# EAGLE design GD32F207RG (EAGLE 9.6.2)
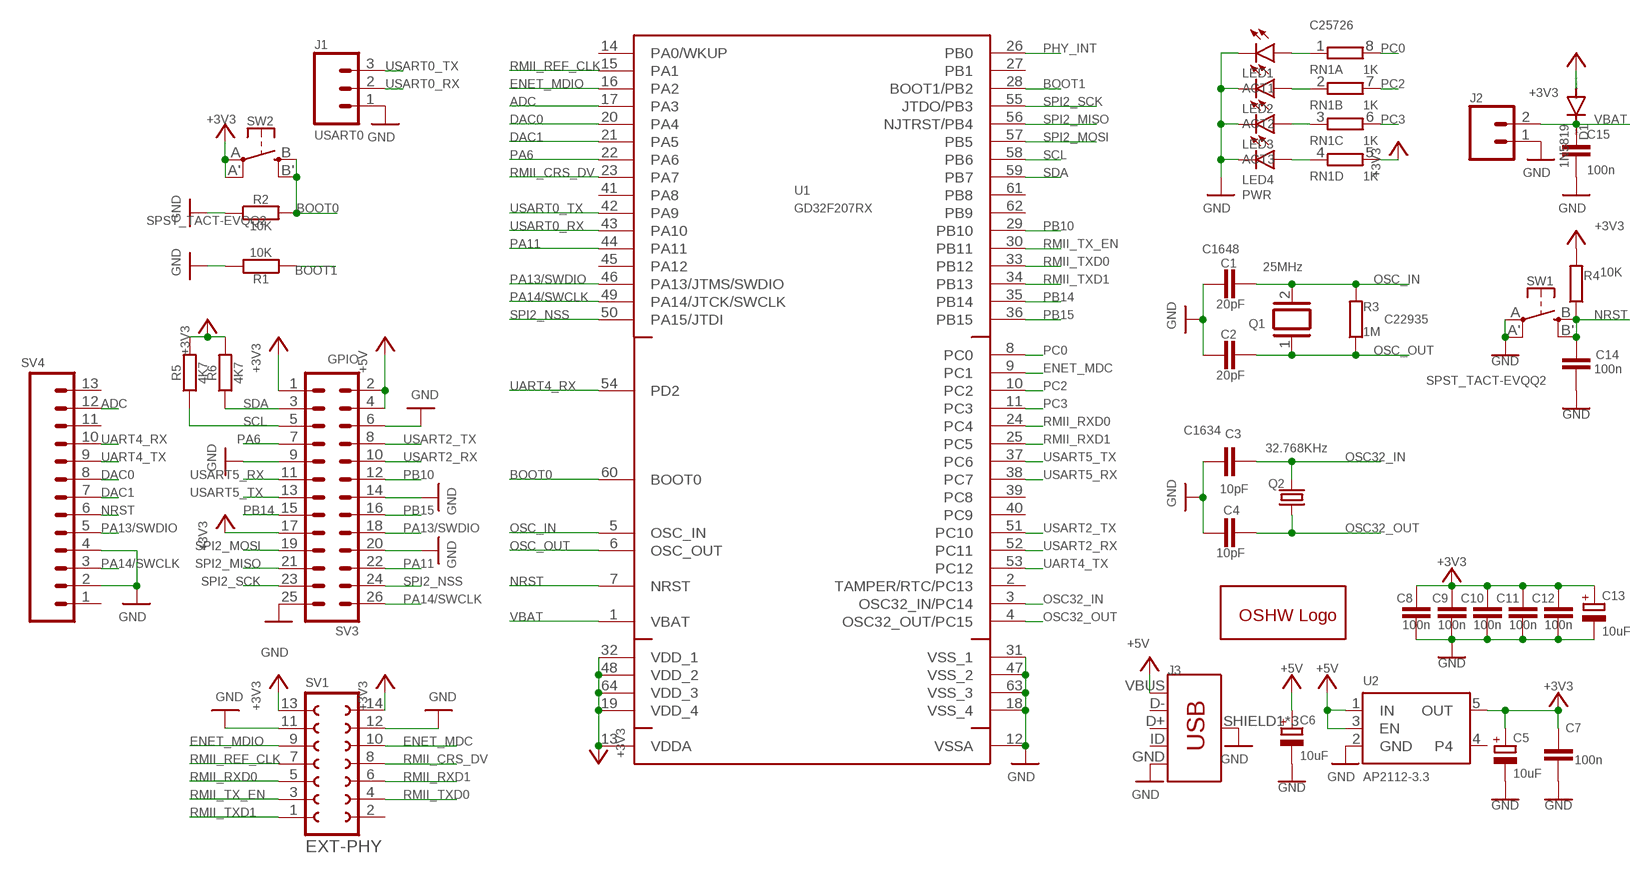
[diagram p0: schematic, sheet 1]

## Parts
C1  20pF  C-EUC0603  [C0603]
C2  20pF  C-EUC0603  [C0603]
C3  10pF  C-EUC0603  [C0603]
C4  10pF  C-EUC0603  [C0603]
C5  10uF  CPOL-EUA/3216-18R  [A/3216-18R]
C6  10uF  CPOL-EUA/3216-18R  [A/3216-18R]
C7  100n  C-EUC0603  [C0603]
C8  100n  C-EUC0603  [C0603]
C9  100n  C-EUC0603  [C0603]
C10  100n  C-EUC0603  [C0603]
C11  100n  C-EUC0603  [C0603]
C12  100n  C-EUC0603  [C0603]
C13  10uF  CPOL-EUA/3216-18R  [A/3216-18R]
C14  100n  C-EUC0603  [C0603]
C15  100n  C-EUC0603  [C0603]
D1  1N5819  DIODE-SOD323-R  [SOD323-R]
GOLD_ORB_SM1  OSHWLOGOLOGO5MM  [OSHW_5MM]
J1  USART0  CONN_03  [1X03]
J2  CONN_02JST-PTH-2  [JST-2-PTH]
J3  USB_MICRO-B_FEMALE-SMT  [USB-B-MICRO-SMD]
LED1  ACT1  LEDCHIP-LED0603  [CHIP-LED0603]
LED2  ACT2  LEDCHIP-LED0603  [CHIP-LED0603]
LED3  ACT3  LEDCHIP-LED0603  [CHIP-LED0603]
LED4  PWR  LEDCHIP-LED0603  [CHIP-LED0603]
Q1  25MHz  XTAL/S  [QS]
Q2  32.768KHz  CRYSTALTC26H  [TC26H]
R1  10K  R-EU_R0603  [R0603]
R2  10K  R-EU_R0603  [R0603]
R3  1M  R-EU_R0603  [R0603]
R4  10K  R-EU_R0603  [R0603]
R5  4K7  R-EU_R0603  [R0603]
R6  4K7  R-EU_R0603  [R0603]
RN1  1K  4R-N0402ARV341  [4X0402ARV341]
SV1  EXT-PHY  FE07-2W  [FE07-2W]
SV3  GPIO  MA13-2  [MA13-2]
SV4  CONN_13  [1X13]
SW1  SPST_TACT-EVQQ2  [EVQ-Q2]
SW2  SPST_TACT-EVQQ2  [EVQ-Q2]
U1  GD32F207RX  [LQFP64]
U2  AP2112-3.3  VREG_SOT23-5  [SOT23-5]

## Nets
+3V3: C5.+ C7.1 C8.1 C9.1 C10.1 C11.1 C12.1 C13.+ D1.A R4.2 R5.2 R6.2 RN1.5 SV1.13 SV1.14 SV3.1 SV3.17 SW2.A'(P1) SW2.A(P) U1.13(VDDA) U1.19(VDD_4) U1.32(VDD_1) U1.48(VDD_2) U1.64(VDD_3) U2.5(OUT)
+5V: C6.+ J3.VBUS SV3.2 SV3.4 U2.1(IN) U2.3(EN)
ADC: SV4.12 U1.17(PA3)
BOOT0: R2.2 SW2.B'(S1) SW2.B(S) U1.60(BOOT0)
BOOT1: R1.1 U1.28(BOOT1/PB2)
DAC0: SV4.8 U1.20(PA4)
DAC1: SV4.7 U1.21(PA5)
ENET_MDC: SV1.10 U1.9(PC1)
ENET_MDIO: SV1.9 U1.16(PA2)
GND: C1.1 C2.1 C3.1 C4.1 C5.- C6.- C7.2 C8.2 C9.2 C10.2 C11.2 C12.2 C13.- C14.2 C15.2 J1.1 J2.1 J3.GND J3.SHIELD1(SHIELD) J3.SHIELD2(SHIELD) J3.SHIELD3(SHIELD) LED1.C LED2.C LED3.C LED4.C R1.2 R2.1 SV1.11 SV1.12 SV3.6 SV3.9 SV3.14 SV3.20 SV3.25 SV4.2 SV4.4 SW1.A'(P1) SW1.A(P) U1.12(VSSA) U1.18(VSS_4) U1.31(VSS_1) U1.47(VSS_2) U1.63(VSS_3) U2.2(GND)
N$10: LED1.A RN1.1
N$11: LED2.A RN1.2
N$25: LED3.A RN1.3
N$26: LED4.A RN1.4
NRST: C14.1 R4.1 SV4.6 SW1.B'(S1) SW1.B(S) U1.7(NRST)
OSC32_IN: C3.2 Q2.2 U1.3(OSC32_IN/PC14)
OSC32_OUT: C4.2 Q2.1 U1.4(OSC32_OUT/PC15)
OSC_IN: C1.2 Q1.2 R3.2 U1.5(OSC_IN)
OSC_OUT: C2.2 Q1.1 R3.1 U1.6(OSC_OUT)
PA6: SV3.7 U1.22(PA6)
PA11: SV3.22 U1.44(PA11)
PA13/SWDIO: SV3.18 SV4.5 U1.46(PA13/JTMS/SWDIO)
PA14/SWCLK: SV3.26 SV4.3 U1.49(PA14/JTCK/SWCLK)
PB10: SV3.12 U1.29(PB10)
PB14: SV3.15 U1.35(PB14)
PB15: SV3.16 U1.36(PB15)
PC0: RN1.8 U1.8(PC0)
PC2: RN1.7 U1.10(PC2)
PC3: RN1.6 U1.11(PC3)
PHY_INT: U1.26(PB0)
RMII_CRS_DV: SV1.8 U1.23(PA7)
RMII_REF_CLK: SV1.7 U1.15(PA1)
RMII_RXD0: SV1.5 U1.24(PC4)
RMII_RXD1: SV1.6 U1.25(PC5)
RMII_TX_EN: SV1.3 U1.30(PB11)
RMII_TXD0: SV1.4 U1.33(PB12)
RMII_TXD1: SV1.1 U1.34(PB13)
SCL: R5.1 SV3.5 U1.58(PB6)
SDA: R6.1 SV3.3 U1.59(PB7)
SPI2_MISO: SV3.21 U1.56(NJTRST/PB4)
SPI2_MOSI: SV3.19 U1.57(PB5)
SPI2_NSS: SV3.24 U1.50(PA15/JTDI)
SPI2_SCK: SV3.23 U1.55(JTDO/PB3)
UART4_RX: SV4.10 U1.54(PD2)
UART4_TX: SV4.9 U1.53(PC12)
USART0_RX: J1.2 U1.43(PA10)
USART0_TX: J1.3 U1.42(PA9)
USART2_RX: SV3.10 U1.52(PC11)
USART2_TX: SV3.8 U1.51(PC10)
USART5_RX: SV3.11 U1.38(PC7)
USART5_TX: SV3.13 U1.37(PC6)
VBAT: C15.1 D1.C J2.2 U1.1(VBAT)
Unconnected: J3.D+ J3.D- J3.ID SV1.2 SV4.1 SV4.11 SV4.13 U1.2(TAMPER/RTC/PC13) U1.14(PA0/WKUP) U1.27(PB1) U1.39(PC8) U1.40(PC9) U1.41(PA8) U1.45(PA12) U1.61(PB8) U1.62(PB9) U2.4

## Library data of the parts
C1 C2 = rcl:C-EU: CAPACITOR, European symbol; JLCPCB: C1648; SPICEPREFIX: C
C3 C4 = rcl:C-EU: CAPACITOR, European symbol; JLCPCB: C1634; SPICEPREFIX: C
C5 C6 C13 = rcl:CPOL-EU: POLARIZED CAPACITOR, European symbol; JLCPCB: C7171; SPICEPREFIX: C
C7-C12 C14 C15 = rcl:C-EU: CAPACITOR, European symbol; JLCPCB: C14663; SPICEPREFIX: C
D1 = diode:DIODE-: DIODE; JLCPCB: C191023
GOLD_ORB_SM1 = oshw:OSHWLOGO: The OSHW logo for PCB layout
J1 = SparkFun-Connectors:CONN_03: Multi connection point. Often used as Generic Header-pin footprint for 0.1 inch spaced/style header connections On any of the 0.1 inch spaced packages, you can populate with these: Break Away Headers - Straight <https://www.sparkfun.com/products/116> (PRT-00116) Break Away Male Headers - Right Angle <https://www.sparkfun.com/products/553> (PRT-00553) Female Headers <https://www.sparkfun.com/products/115> (PRT-00115) Break Away Headers - Machine Pin <https://www.sparkfun.com/products/117> (PRT-00117) Break Away Female Headers - Swiss Machine Pin <https://www.sparkfun.com/products/743> (PRT-00743) Stackable Header - 3 Pin (Female, 0.1") <https://www.sparkfun.com/products/13875> (PRT-13875) For SCREWTERMINALS and SPRING TERMINALS visit here: Screw Terimnals on SparkFun.com <https://www.sparkfun.com/search/results?term=Screw+Terminals> (5mm/3.5mm/2.54mm spacing) This device is also useful as a general connection point to wire up your design to another part of your project. Our various solder wires solder well into these plated through hole pads. Hook-Up Wire - Assortment (Stranded, 22 AWG) <https://www.sparkfun.com/products/11375> (PRT-11375) Hook-Up Wire - Assortment (Solid Core, 22 AWG) <https://www.sparkfun.com/products/11367> (PRT-11367) View the entire wire category on our website here <https://www.sparkfun.com/categories/141> Special notes: Molex polarized connector foot print use with SKU : PRT-08232 with associated crimp pins and housings.
J2 = SparkFun-Connectors:CONN_02: Multi connection point. Often used as Generic Header-pin footprint for 0.1 inch spaced/style header connections On any of the 0.1 inch spaced packages, you can populate with these: Break Away Headers - Straight <https://www.sparkfun.com/products/116> (PRT-00116) Break Away Male Headers - Right Angle <https://www.sparkfun.com/products/553> (PRT-00553) Female Headers <https://www.sparkfun.com/products/115> (PRT-00115) Break Away Headers - Machine Pin <https://www.sparkfun.com/products/117> (PRT-00117) Break Away Female Headers - Swiss Machine Pin <https://www.sparkfun.com/products/743> (PRT-00743) For SCREWTERMINALS and SPRING TERMINALS visit here: Screw Terimnals on SparkFun.com <https://www.sparkfun.com/search/results?term=Screw+Terminals> (5mm/3.5mm/2.54mm spacing) This device is also useful as a general connection point to wire up your design to another part of your project. Our various solder wires solder well into these plated through hole pads. Hook-Up Wire - Assortment (Stranded, 22 AWG) <https://www.sparkfun.com/products/11375> (PRT-11375) Hook-Up Wire - Assortment (Solid Core, 22 AWG) <https://www.sparkfun.com/products/11367> (PRT-11367) View the entire wire category on our website here <https://www.sparkfun.com/categories/141> Special notes: Molex polarized connector foot print use with: PRT-08233 with associated crimp pins and housings. 2.54_SCREWTERM for use with PRT-10571. 3.5mm Screw Terminal footprints for PRT-08084 5mm Screw Terminal footprints for use with PRT-08432; PROD_ID: CONN-09863; SKU: PRT-09914
J3 = USB-micro:USB_MICRO-B: USB Type Micro-B Connector Male/female and PTH/SMT variants SparkFun Products: SparkFun microB USB Breakout <https://www.sparkfun.com/products/12035> SparkFun USB microB Plug Breakout <https://www.sparkfun.com/products/10031> SparkFun ESP8266 Thing <https://www.sparkfun.com/products/13231>; JLCPCB: C404968; PROD_ID: CONN-11752
LED1-LED4 = led:LED: LED OSRAM: - CHIPLED LG R971, LG N971, LY N971, LG Q971, LY Q971, LO R971, LY R971 LH N974, LH R974 LS Q976, LO Q976, LY Q976 LO Q996 - Hyper CHIPLED LW Q18S LB Q993, LB Q99A, LB R99A - SideLED LS A670, LO A670, LY A670, LG A670, LP A670 LB A673, LV A673, LT A673, LW A673 LH A674 LY A675 LS A676, LA A676, LO A676, LY A676, LW A676 LS A679, LY A679, LG A679 - Hyper Micro SIDELED® LS Y876, LA Y876, LO Y876, LY Y876 LT Y87S - SmartLED LW L88C, LW L88S LB L89C, LB L89S, LG L890 LS L89K, LO L89K, LY L89K LS L896, LA L896, LO L896, LY L896 - TOPLED LS T670, LO T670, LY T670, LG T670, LP T670 LSG T670, LSP T670, LSY T670, LOP T670, LYG T670 LG T671, LOG T671, LSG T671 LB T673, LV T673, LT T673, LW T673 LH T674 LS T676, LA T676, LO T676, LY T676, LB T676, LH T676, LSB T676, LW T676 LB T67C, LV T67C, LT T67C, LS T67K, LO T67K, LY T67K, LW E67C LS E67B, LA E67B, LO E67B, LY E67B, LB E67C, LV E67C, LT E67C LW T67C LS T679, LY T679, LG T679 LS T770, LO T770, LY T770, LG T770, LP T770 LB T773, LV T773, LT T773, LW T773 LH T774 LS E675, LA E675, LY E675, LS T675 LS T776, LA T776, LO T776, LY T776, LB T776 LHGB T686 LT T68C, LB T68C - Hyper Mini TOPLED® LB M676 - Mini TOPLED Santana® LG M470 LS M47K, LO M47K, LY M47K Source: http://www.osram.convergy.de LUXEON: - LUMILED® LXK2-PW12-R00, LXK2-PW12-S00, LXK2-PW14-U00, LXK2-PW14-V00 LXK2-PM12-R00, LXK2-PM12-S00, LXK2-PM14-U00 LXK2-PE12-Q00, LXK2-PE12-R00, LXK2-PE12-S00, LXK2-PE14-T00, LXK2-PE14-U00 LXK2-PB12-K00, LXK2-PB12-L00, LXK2-PB12-M00, LXK2-PB14-N00, LXK2-PB14-P00, LXK2-PB14-Q00 LXK2-PR12-L00, LXK2-PR12-M00, LXK2-PR14-Q00, LXK2-PR14-R00 LXK2-PD12-Q00, LXK2-PD12-R00, LXK2-PD12-S00 LXK2-PH12-R00, LXK2-PH12-S00 LXK2-PL12-P00, LXK2-PL12-Q00, LXK2-PL12-R00 Source: www.luxeon.com KINGBRIGHT: KA-3528ASYC Source: www.kingbright.com
Q1 = special:XTAL/S: CRYSTAL
Q2 = crystal:CRYSTAL: CRYSTAL; OC_FARNELL: unknown; OC_NEWARK: unknown
R1 R2 R4 = rcl:R-EU_: RESISTOR, European symbol; JLCPCB: C25804; SPICEPREFIX: R
R3 = rcl:R-EU_: RESISTOR, European symbol; JLCPCB: C22935; SPICEPREFIX: R
R5 R6 = rcl:R-EU_: RESISTOR, European symbol; JLCPCB: C23162; SPICEPREFIX: R
RN1 = resistor-dil:4R-N: Array Chip Resistor Source: RS Component / Phycomp; JLCPCB: C25726; OC_FARNELL: unknown; OC_NEWARK: unknown
SV1 = con-lsta:FE07-2W: FEMALE HEADER; OC_FARNELL: unknown; OC_NEWARK: unknown
SV3 = con-lstb:MA13-2: PIN HEADER; OC_FARNELL: unknown; OC_NEWARK: unknown
SV4 = SparkFun-Connectors:CONN_13: Multi connection point. Often used as Generic Header-pin footprint for 0.1 inch spaced/style header connections On any of the 0.1 inch spaced packages, you can populate with these: Break Away Headers - Straight <https://www.sparkfun.com/products/116> (PRT-00116) Break Away Male Headers - Right Angle <https://www.sparkfun.com/products/553> (PRT-00553) Female Headers <https://www.sparkfun.com/products/115> (PRT-00115) Break Away Headers - Machine Pin <https://www.sparkfun.com/products/117> (PRT-00117) Break Away Female Headers - Swiss Machine Pin <https://www.sparkfun.com/products/743> (PRT-00743) For SCREWTERMINALS and SPRING TERMINALS visit here: Screw Terimnals on SparkFun.com <https://www.sparkfun.com/search/results?term=Screw+Terminals> (5mm/3.5mm/2.54mm spacing) This device is also useful as a general connection point to wire up your design to another part of your project. Our various solder wires solder well into these plated through hole pads. Hook-Up Wire - Assortment (Stranded, 22 AWG) <https://www.sparkfun.com/products/11375> (PRT-11375) Hook-Up Wire - Assortment (Solid Core, 22 AWG) <https://www.sparkfun.com/products/11367> (PRT-11367) View the entire wire category on our website here <https://www.sparkfun.com/categories/141> Special notes: Molex polarized connector foot print use with SKU : PRT-08231 with associated crimp pins and housings. 1MM SMD Version SKU: PRT-10208 NOTES ON THE VARIANTS LOCK and LOCK_LONGPADS... This footprint was designed to help hold the alignment of a through-hole component (i.e. 6-pin header) while soldering it into place. You may notice that each hole has been shifted either up or down by 0.005 of an inch from it's more standard position (which is a perfectly straight line). This slight alteration caused the pins (the squares in the middle) to touch the edges of the holes. Because they are alternating, it causes a "brace" to hold the component in place. 0.005 has proven to be the perfect amount of "off-center" position when using our standard breakaway headers. Although looks a little odd when you look at the bare footprint, once you have a header in there, the alteration is very hard to notice. Also,if you push a header all the way into place, it is covered up entirely on the bottom side.
SW1 SW2 = adafruit:SPST_TACT: SMT 6mm switch, EVQQ2 series http://www.ladyada.net/library/eagle
U1 = GD3F207Rx:GD32F207RX: The GD32F207xx device belongs to the performance line of GD32 MCU Family.; DATASHEET: http://www.gd32mcu.com/en/download/0?kw=GD32F2; SUPPLIER: GigaDevice
U2 = microbuilder:VREG_SOT23-5: SOT23-5 Fixed Voltage Regulators Part Current Out V Out V In V Dropout θJA (°C/W) TJ (°C) Digikey Part No. ADP121 150mA 3.3V 3.4-5.5V 0.09V @ 150mA -- -- ADP121-AUJZ33R7CT-ND ADP121 150mA 3.0V 3.1-5.5V 0.09V @ 150mA -- -- ADP121-AUJZ30R7CT-ND ADP122 300mA 3.3V 3.4-5.5V 0.085V @ 300mA -- -- ADP122AUJZ-3.3-R7CT-ND ADP1712 300mA 3.3V 3.5-5.5V 0.17V @ 300mA -- -- ADP1712AUJZ-3.3-R7TR-ND AP7311 (Low Cost) 150mA 3.3V 3.5-6V 0.15V @ 150mA -- -- AP7311-33WG-7DICT-ND LD39015M18R 150mA 1.8V 1.9V-5.5V 0.08V @ 100mA -- -- 497-6977-1-ND LP2985A-33DBVR 150mA 3.3V 3.3-16V 0.28V @ 150mA 206 150 296-18479-1-ND MCP1824T-3302E/OT 300mA 3.3V 3.5V-6V 0.2V @ 300mA -- -- MCP1824T-3302E/OTCT-ND MIC5205-2.5YM5 TR 150mA 2.5V 2.7-16V 0.165V @ 150mA -- -- 576-1257-2-ND MIC5205-3.0YM5 TR 150mA 3.0V 3.2V-16V 0.165V @ 150mA -- -- 576-1258-2-ND MIC5205-3.3YM5 TR 150mA 3.3V 3.5V-16V 0.165V @ 150mA -- -- 576-1259-2-ND TPS780330220 150mA 3.3V+2.2V 3.6-5.5V 250mV Max -- -- 296-23332-1-ND TDA3663/N1,135 100mA 3.3V 3.5-45V 0.18V @ 50mA -- -- 568-5343-1-ND Max operating temp can be calculated using θJA, TJ (max junction temperature), and power in watts. Set the "Maximum Ambient Temperature" until it reaches TJ ("Max Junction Temperature"), which is the absolute limit for safe use of the regulator: Heat Sink Temperature Calculator <http://www.daycounter.com/Calculators/Heat-Sink-Temperature-Calculator.phtml> For example, With 12V source into a 3.3V LP2985 and a 30mA load, we are dissipating (12V-3.3V) * 0.03A = 0.261W. With a θJA of 206 °C/W, a TJ of 150°C, and 261mW we can safely use the chip without a heat sink up to 75°C (=147.1°C Junction Temperature).; JLCPCB: C51118

## Board
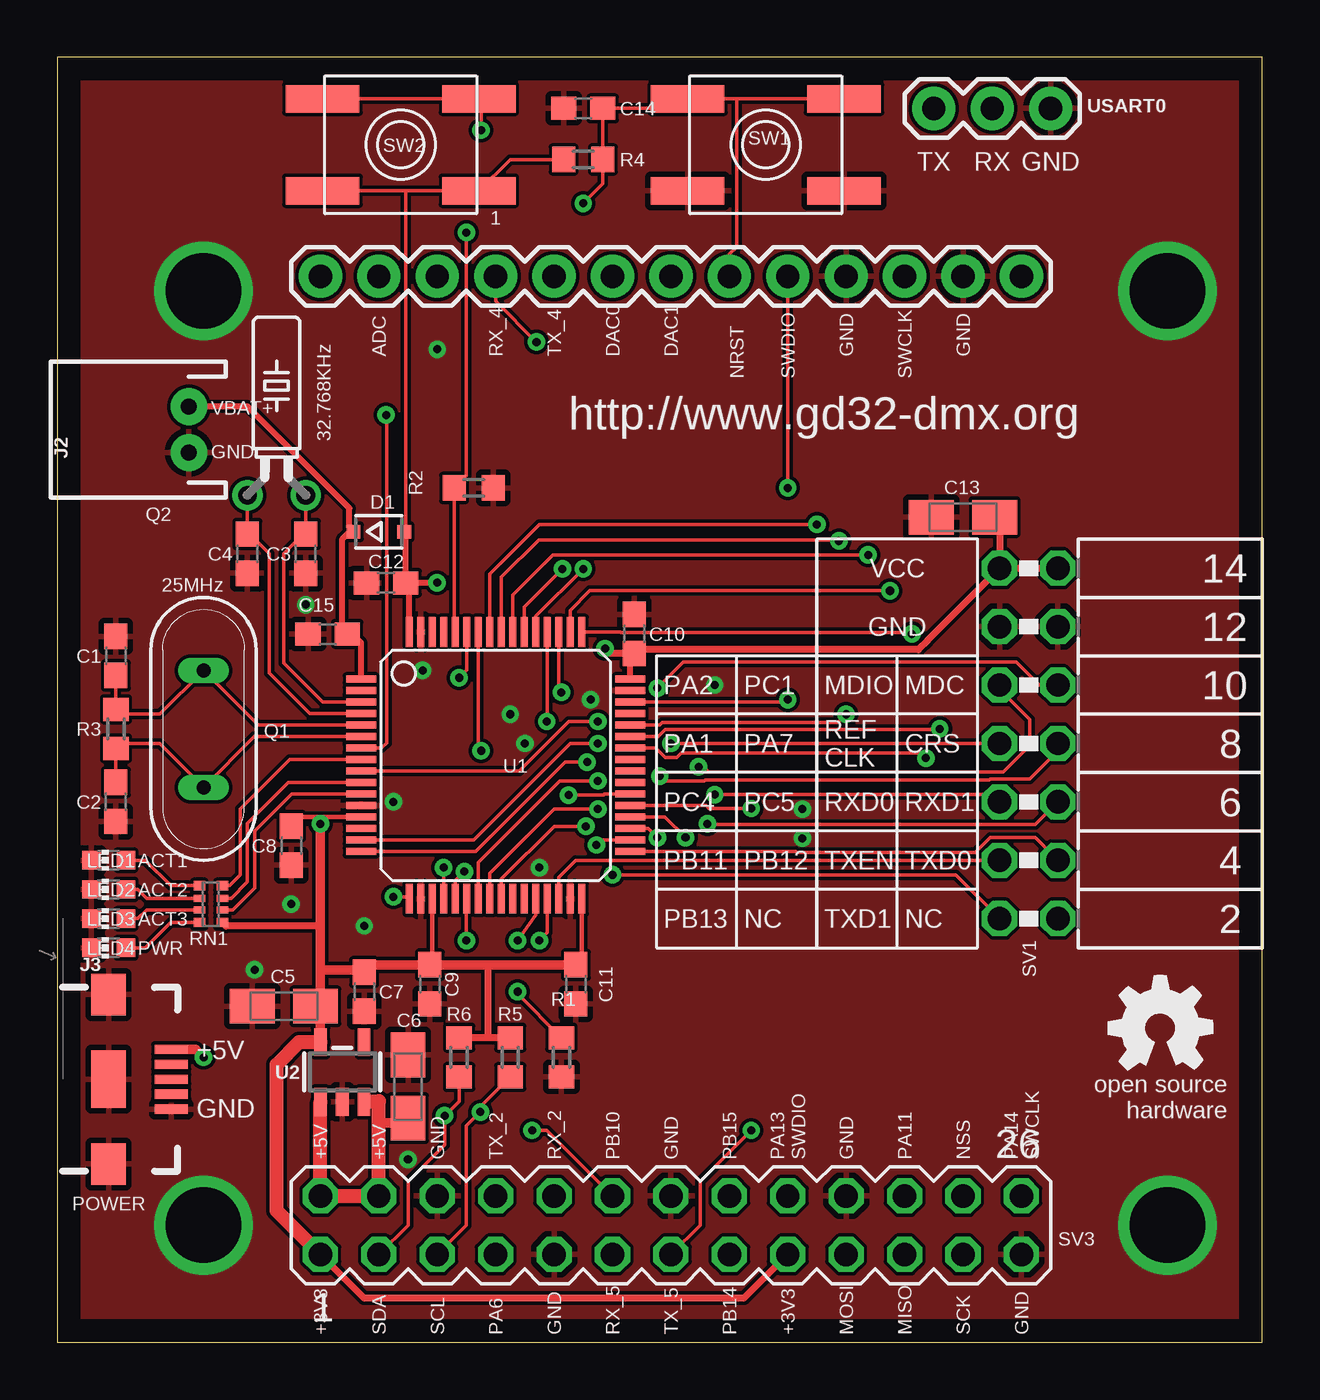
[diagram p1: board, top side]
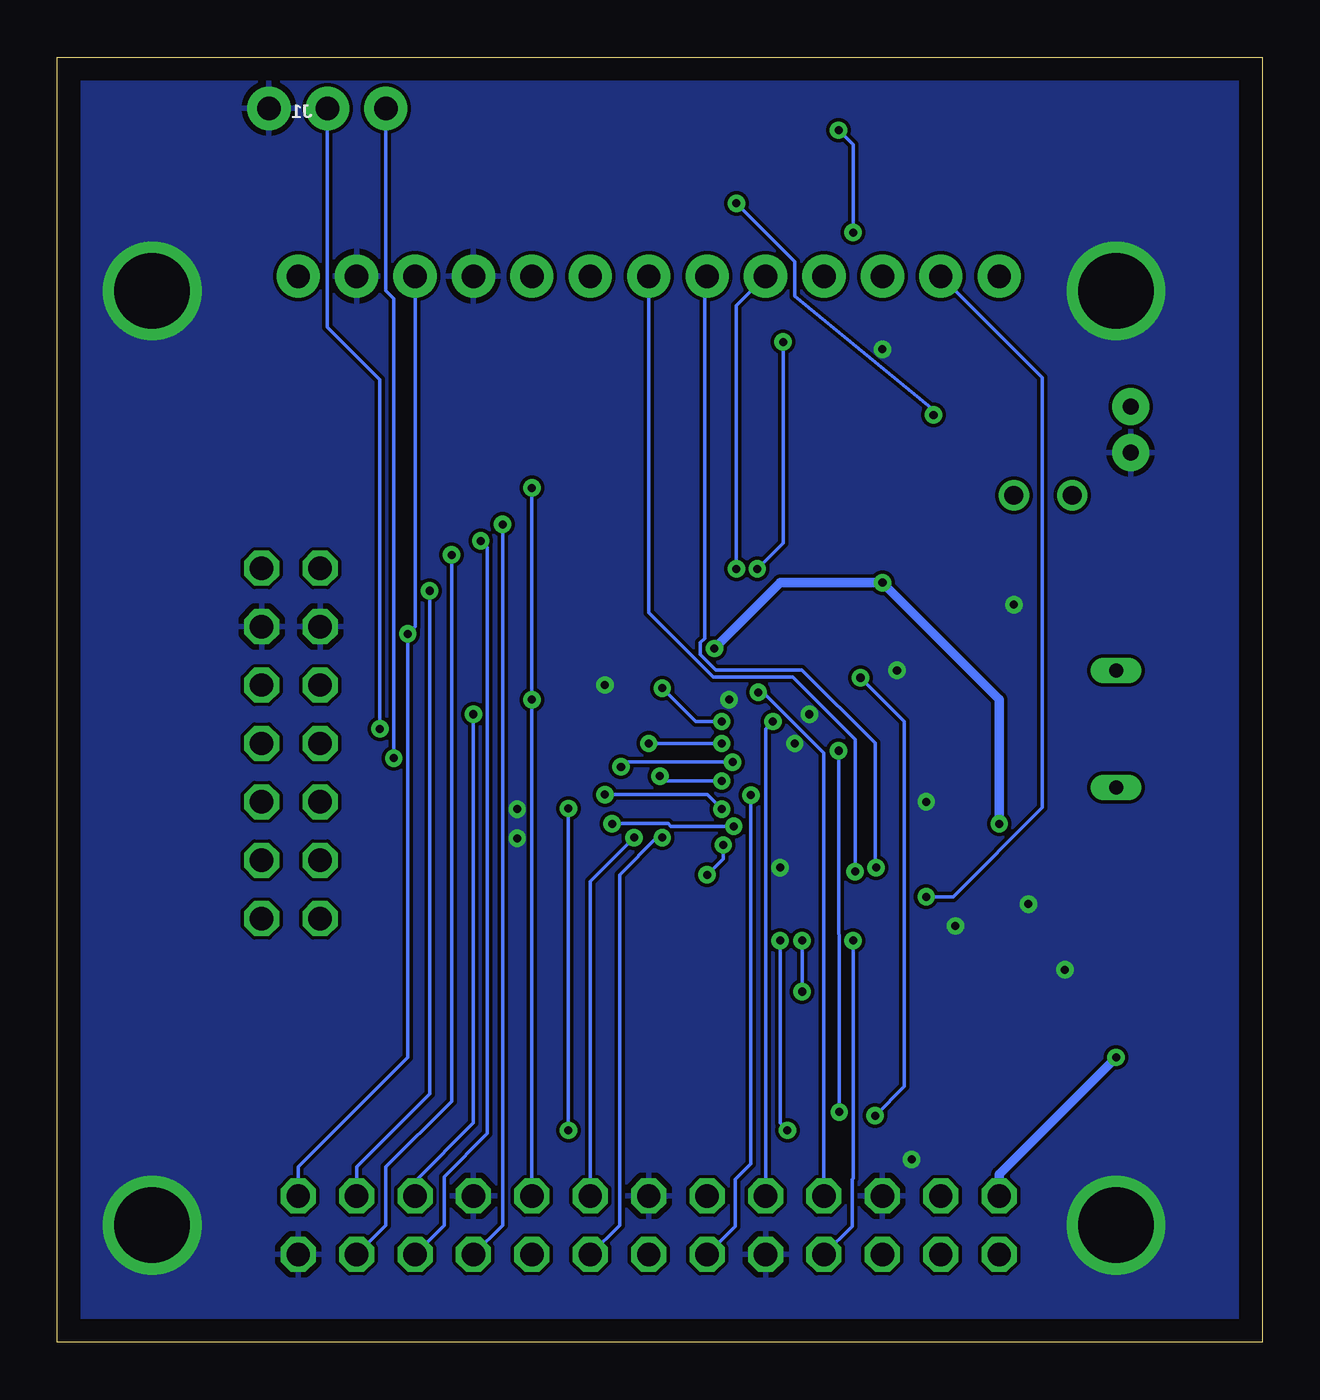
[diagram p2: board, bottom side, seen from below]

Size 52.38 x 55.87 mm. Coordinates in mm from the lower left corner, seen from the top.
Outline: 0,0 52.38,0 52.38,55.87 0,55.87 0,0
Copper layers (1*16): Top 0.035mm / dielectric 1.5mm / Bottom 0.035mm
Design rules "default": minimum track width 6mil, minimum drill 0.35mm, track to track 6mil, track to pad 6mil, pad to pad 6mil, via to via 6mil, smd to smd 6mil, copper to edge 40mil, drill to drill 6mil, minimum pad ring 10mil, minimum via ring 8mil, stop-mask expansion 4mil, vias tented up to drill 0mil, thermal gap 10mil

### Footprints (pad centres in the part's own frame; a part is rotated, then mirrored left to right if it is on the bottom)
C0603 = smd 1.1 x 1: 1 -0.85,0; 2 0.85,0
A/3216-18R = smd 1.95 x 1.5: + 1.375,0; - -1.375,0
SOD323-R = smd 0.6 x 0.6: A 1.1,0; C -1.1,0
1X03 = drill 1.016 pad 1.88: 1 0,0; 2 2.54,0; 3 5.08,0
JST-2-PTH = drill 0.7 pad 1.6: 1 -1,0; 2 1,0
USB-B-MICRO-SMD = smd 1.45 x 0.4: D+ 2.725,0; D- 2.725,0.65; GND 2.725,-1.3; ID 2.725,-0.65; VBUS 2.725,1.3 | smd 1.5 x 1.8: SHIELD1 0,3.685; SHIELD2 0,-3.685 | smd 1.5 x 2.5: SHIELD3 0,0
CHIP-LED0603 = smd 0.8 x 0.8: A 0,-0.75; C 0,0.75
QS = drill 0.61 long: 1 -2.54,0; 2 2.54,0
TC26H = drill 0.813: 1 -1.27,0; 2 1.27,0
R0603 = smd 1 x 1.1: 1 -0.85,0; 2 0.85,0
4X0402ARV341 = smd 0.4 x 0.5: 1 -0.8,-0.5; 4 0.8,-0.5; 5 0.8,0.5; 8 -0.8,0.5 | smd 0.3 x 0.5: 2 -0.25,-0.5; 3 0.25,-0.5; 6 0.25,0.5; 7 -0.25,0.5
FE07-2W = drill 1.016 octagon: 1 -7.62,1.27; 2 -7.62,-1.27; 3 -5.08,1.27; 4 -5.08,-1.27; 5 -2.54,1.27; 6 -2.54,-1.27; 7 0,1.27; 8 0,-1.27; 9 2.54,1.27; 10 2.54,-1.27; 11 5.08,1.27; 12 5.08,-1.27; 13 7.62,1.27; 14 7.62,-1.27
MA13-2 = drill 1.016 octagon: 1 -15.24,-1.27; 2 -15.24,1.27; 3 -12.7,-1.27; 4 -12.7,1.27; 5 -10.16,-1.27; 6 -10.16,1.27; 7 -7.62,-1.27; 8 -7.62,1.27; 9 -5.08,-1.27; 10 -5.08,1.27; 11 -2.54,-1.27; 12 -2.54,1.27; 13 0,-1.27; 14 0,1.27; 15 2.54,-1.27; 16 2.54,1.27; 17 5.08,-1.27; 18 5.08,1.27; 19 7.62,-1.27; 20 7.62,1.27; 21 10.16,-1.27; 22 10.16,1.27; 23 12.7,-1.27; 24 12.7,1.27; 25 15.24,-1.27; 26 15.24,1.27
1X13 = drill 1.016 pad 1.88: 1 0,0; 2 2.54,0; 3 5.08,0; 4 7.62,0; 5 10.16,0; 6 12.7,0; 7 15.24,0; 8 17.78,0; 9 20.32,0; 10 22.86,0; 11 25.4,0; 12 27.94,0; 13 30.48,0
EVQ-Q2 = smd 3.2 x 1.2: A -3.4,-2; A' 3.4,-2; B -3.4,2; B' 3.4,2
LQFP64 = smd 1.3 x 0.3: 1 -5.85,3.75; 2 -5.85,3.25; 3 -5.85,2.75; 4 -5.85,2.25; 5 -5.85,1.75; 6 -5.85,1.25; 7 -5.85,0.75; 8 -5.85,0.25; 9 -5.85,-0.25; 10 -5.85,-0.75; 11 -5.85,-1.25; 12 -5.85,-1.75; 13 -5.85,-2.25; 14 -5.85,-2.75; 15 -5.85,-3.25; 16 -5.85,-3.75; 33 5.85,-3.75; 34 5.85,-3.25; 35 5.85,-2.75; 36 5.85,-2.25; 37 5.85,-1.75; 38 5.85,-1.25; 39 5.85,-0.75; 40 5.85,-0.25; 41 5.85,0.25; 42 5.85,0.75; 43 5.85,1.25; 44 5.85,1.75; 45 5.85,2.25; 46 5.85,2.75; 47 5.85,3.25; 48 5.85,3.75 | smd 0.3 x 1.3: 17 -3.75,-5.8; 18 -3.25,-5.8; 19 -2.75,-5.8; 20 -2.25,-5.8; 21 -1.75,-5.8; 22 -1.25,-5.8; 23 -0.75,-5.8; 24 -0.25,-5.8; 25 0.25,-5.8; 26 0.75,-5.8; 27 1.25,-5.8; 28 1.75,-5.8; 29 2.25,-5.8; 30 2.75,-5.8; 31 3.25,-5.8; 32 3.75,-5.8; 49 3.75,5.8; 50 3.25,5.8; 51 2.75,5.8; 52 2.25,5.8; 53 1.75,5.8; 54 1.25,5.8; 55 0.75,5.8; 56 0.25,5.8; 57 -0.25,5.8; 58 -0.75,5.8; 59 -1.25,5.8; 60 -1.75,5.8; 61 -2.25,5.8; 62 -2.75,5.8; 63 -3.25,5.8; 64 -3.75,5.8
SOT23-5 = smd 0.55 x 1.2: 1 -0.95,-1.3; 2 0,-1.3; 3 0.95,-1.3; 4 0.95,1.3; 5 -0.95,1.3

### Placement (x,y rotation side)
C1  2.54,29.84 270 top
C2  2.54,23.5 90 top
C3  10.79,34.29 90 top
C4  8.26,34.29 90 top
C5  9.84,14.61 0 top
C6  15.24,11.11 270 top
C7  13.34,15.24 270 top
C8  10.16,21.59 270 top
C9  16.19,15.56 270 top
C10  25.08,30.8 90 top
C11  22.54,15.56 270 top
C12  14.29,33.02 180 top
C13  39.37,35.88 0 top
C14  22.86,53.66 180 top
C15  11.75,30.8 180 top
D1  13.97,35.24 0 top
GOLD_ORB_SM1  47.94,13.65 0 top
J1  43.18,53.66 180 top
J2  5.71,39.69 90 top
J3  2.22,11.43 0 top
LED1  2.22,20.95 90 top
LED2  2.22,19.68 90 top
LED3  2.22,18.41 90 top
LED4  2.22,17.14 90 top
Q1  6.35,26.67 90 top
Q2  9.53,36.83 0 top
R1  21.91,12.38 270 top
R2  18.1,37.15 180 top
R3  2.54,26.67 90 top
R4  22.86,51.44 180 top
R5  19.68,12.38 90 top
R6  17.46,12.38 90 top
RN1  6.67,19.05 270 top
SV1  42.23,26.04 90 top
SV3  26.67,5.08 0 top
SV4  41.91,46.35 180 top
SW1  30.8,52.07 0 top
SW2  14.92,52.07 0 top
U1  19.05,25.08 0 top
U2  12.38,11.75 0 top

### Tracks (layer width: path | path; a pad name or v marks a point on that pad's centre or on a via)
+3V3  (via drill 0.35)
  Top 0.152: 24.9,29.77 C10.1 | SW2.A 15.08,50.07 | 15.08,50.07 SW2.A' 19.69,51.44 R4.2 | 15.08,50.07 15.14,50.01 15.14,35.56 15.14,35.17 | 7.32,18.1 RN1.5 | 10.55,22.83 C8.1
  Top 0.203: U1.32 22.8,16.66 | U1.19 16.3,16.52 C9.1 | U1.13 11.43,22.83 | 11.43,22.83 10.55,22.83 | v11.43,22.54 11.43,22.83
  Top 0.254: 24.9,30 25.07,30.16 | U1.48 24.9,29.77 | U1.64 15.3,32.86 C12.1 | C12.1 15.14,35.17 D1.A | v16.51,33.02 v16.5,33.02 C12.1
  Top 0.305: 25.07,30.16 C10.1 24.03,29.95 v23.81,30.16 | SV1.13 SV1.14 | U2.5 | C5.+ 11.43,14.39 | C13.+ 40.96,35.66 SV1.13 | 24.9,30 25.02,30.11 37.43,30.11 37.83,30.52 37.83,30.53 SV1.13 | SV3.17 29.84,1.91 13.34,1.91 SV3.1 | R5.2 18.73,13.23 | 18.73,13.23 R6.2 | 11.43,18.1 7.32,18.1 | 13.23,16.19 C7.1 13.65,16.41 | 18.73,13.23 18.73,16.41
  Top 0.406: 11.43,14.39 U2.5 | 11.43,16.19 11.43,14.92 11.22,14.71 C5.+ | 11.43,16.19 11.43,18.1 v11.43,22.54 | 11.43,16.19 13.23,16.19 | 22.8,16.66 C11.1 18.73,16.41 C9.1 13.65,16.41
  Top 0.61: SV3.1 9.53,5.71 9.53,12.06 10.51,13.05 U2.5
  Bottom 0.406: v23.81,30.16 20.95,33.02 v16.51,33.02 11.43,27.95 v11.43,22.54
+5V  (via drill 0.35)
  Top 0.152: U2.1 | U2.3 13.36,10.48
  Top 0.406: J3.VBUS 6,12.73 v6.35,12.38 | C6.+ 15.03,9.53 13.97,9.53
  Top 0.61: U2.1 SV3.2 SV3.4 13.97,9.53 13.97,10.48 13.36,10.48
  Bottom 0.406: v6.35,12.38 11.43,7.3 SV3.2
ADC  (via drill 0.35)
  Top 0.152: U1.17 15.21,19.37 v14.61,19.37
  Bottom 0.152: SV4.12 9.55,41.94 9.55,23.24 13.43,19.37 v14.61,19.37
BOOT0  (via drill 0.35)
  Top 0.152: SW2.B SW2.B' 18.41,53.98 v18.41,52.7 | U1.60 17.25,30.93 R2.2 17.78,37.68 v17.78,48.26
  Bottom 0.152: v17.78,48.26 17.78,52.07 v18.41,52.7
BOOT1  (via drill 0.35)
  Top 0.152: U1.28 20.8,18.58 v20,17.46 | R1.1 20,15.14 v20,15.24
  Bottom 0.152: v20,17.46 v20,15.24
DAC0  (via drill 0.35)
  Top 0.152: U1.20 16.78,19.3 v16.78,20.64
  Bottom 0.152: v16.78,20.64 16.83,20.68 16.83,26.05 20.02,29.24 23.75,29.24 24.42,29.91 24.42,30.41 24.24,30.59 24.24,46.15 24.13,46.26 SV4.8
DAC1  (via drill 0.35)
  Top 0.152: U1.21 17.3,20.07 v17.69,20.46
  Bottom 0.152: v17.69,20.46 17.69,26.21 20.42,28.93 23.87,28.93 26.67,31.73 SV4.7
ENET_MDC  (via drill 0.35)
  Top 0.152: U1.9 20.07,24.83 22.23,26.99 v23.5,26.99 | SV1.10 42.68,28.57 41.69,29.57 27.21,29.57 v26.08,28.44
  Bottom 0.152: v26.08,28.44 24.63,26.99 v23.5,26.99
ENET_MDIO  (via drill 0.35)
  Top 0.152: U1.16 18.19,21.33 22.07,25.22 v23.02,25.22 | v27.88,25.02 28.09,25.02 28.31,24.79 41.12,24.79 42.27,25.94 42.27,27.08 40.96,28.39 SV1.9
  Bottom 0.152: v23.02,25.22 27.67,25.22 v27.88,25.02
GND  (via drill 0.35, 3.28)
  other vias: 6.35,5.08 48.26,5.08 6.35,45.72 48.26,45.72 28.57,28.57 32.38,23.18 32.38,21.91 23.18,27.94 15.24,7.94 20.95,20.64 19.68,27.3 20.32,26.04 15.88,29.21 16.51,43.18 13.34,18.1 10.16,19.05 8.57,16.19 10.79,32.07 14.61,23.5
  pour Top: 0,55.88 0,0 52.39,0 52.39,55.88
  pour Bottom: 0,55.88 0,0 52.39,0 52.39,55.88
N$10
  Top 0.152: RN1.1 4.92,19.85 3.81,20.95 LED1.A
N$11
  Top 0.152: RN1.2 3.88,19.3 3.49,19.68 LED2.A
N$25
  Top 0.152: RN1.3 3.88,18.8 3.49,18.41 LED3.A
N$26
  Top 0.152: RN1.4 4.92,18.25 3.81,17.14 LED4.A
NRST  (via drill 0.35)
  Top 0.152: U1.7 14.09,25.83 14.32,26.06 14.32,40.29 v14.29,40.32 | 29.53,54.07 SW1.B 26.98,53.66 C14.1 R4.1 23.71,50.38 v22.86,49.53 | 29.53,54.07 SW1.B' | SV4.6 29.21,47.31 29.53,47.62 29.53,54.07
  Bottom 0.152: v22.86,49.53 20.32,46.99 20.32,45.5 14.29,40.53 v14.29,40.32
OSC32_IN
  Top 0.152: Q2.2 10.79,35.24 | 10.79,35.24 C3.2 | 10.79,35.24 9.84,34.29 9.84,29.53 11.54,27.83 U1.3
OSC32_OUT
  Top 0.152: Q2.1 C4.2 8.36,35.14 9.21,34.29 9.21,29.1 10.97,27.33 U1.4
OSC_IN
  Top 0.152: U1.5 8.73,26.83 Q1.2 4.45,27.3 2.54,27.3 R3.2 C1.2
OSC_OUT
  Top 0.152: U1.6 8.55,26.33 Q1.1 4.45,26.04 2.54,26.04 R3.1 C2.2
PA6  (via drill 0.35)
  Top 0.152: U1.22 17.78,19.26 v17.78,17.46
  Bottom 0.152: v17.78,17.46 17.78,7.12 17.82,7.08 17.82,5.04 SV3.7
PA11  (via drill 0.35)
  Top 0.152: U1.44 26.18,26.83 26.29,26.95 33.93,26.95 v34.29,27.3
  Bottom 0.152: SV3.22 36.83,6.99 34.29,9.53 v34.29,27.3
PA13/SWDIO  (via drill 0.35)
  Top 0.152: U1.46 31.64,27.83 v31.75,27.94 | SV4.5 v31.75,37.15
  Bottom 0.152: SV3.18 v31.75,27.94 v31.75,37.15
PA14/SWCLK  (via drill 0.35)
  Top 0.152: v37.15,30.8 37.08,30.87 24.49,30.87 24.47,30.88 U1.49
  Bottom 0.152: SV3.26 41.91,7.62 37.15,12.38 v37.15,30.8 36.83,31.11 SV4.3
PB10  (via drill 0.35)
  Top 0.152: v20.64,9.21 21.27,9.21 SV3.12 | U1.29 21.3,17.81 v20.95,17.46
  Bottom 0.152: v20.95,17.46 20.95,9.53 v20.64,9.21
PB14  (via drill 0.35)
  Top 0.152: U1.35 25.69,22.33 v26.08,21.94
  Bottom 0.152: SV3.15 27.94,5.08 27.94,20.32 26.32,21.94 v26.08,21.94
PB15  (via drill 0.35)
  Top 0.152: U1.36 26.41,22.83 v27.3,21.94
  Bottom 0.152: v27.3,21.94 29.21,20.03 SV3.16
PC0
  Top 0.152: RN1.8 7.49,19.85 7.95,20.32 7.95,23.18 10.11,25.33 U1.8
PC2
  Top 0.152: RN1.7 7.55,19.3 8.26,20 8.26,22.56 10.03,24.33 U1.10
PC3
  Top 0.152: RN1.6 7.62,18.8 8.57,19.75 8.57,22.23 10.18,23.83 U1.11
RMII_CRS_DV  (via drill 0.35)
  Top 0.152: SV1.8 43.5,25.72 42.27,24.49 40.55,24.49 40.51,24.45 28.16,24.45 28.13,24.41 26.39,24.41 v26.18,24.61 | v23.5,24.4 21.85,24.4 20.95,23.5 18.3,20.86 U1.23
  Bottom 0.152: v23.5,24.4 25.98,24.4 v26.18,24.61
RMII_REF_CLK  (via drill 0.35)
  Top 0.152: U1.15 18.1,21.83 22.3,26.04 v23.5,26.04 | v26.67,26.04 SV1.7
  Bottom 0.152: v26.67,26.04 v23.5,26.04
RMII_RXD0  (via drill 0.35)
  Top 0.152: v28.57,23.81 40.64,23.81 SV1.5 | v23.5,23.18 21.59,23.18 18.8,20.39 U1.24
  Bottom 0.152: v28.57,23.81 24.13,23.81 v23.5,23.18
RMII_RXD1  (via drill 0.35)
  Top 0.152: v22.97,22.43 21.91,22.43 21.82,22.43 21.59,22.43 19.3,20.14 U1.25 | v28.26,22.54 28.29,22.51 32.64,22.51 32.65,22.5 42.51,22.5 SV1.6
  Bottom 0.152: v22.97,22.43 25.71,22.43 25.83,22.55 v28.25,22.55 v28.26,22.54
RMII_TX_EN
  Top 0.152: SV1.3 25.65,20.95 25.64,20.95 24.16,20.95 24.15,20.95 22.54,20.95 21.8,20.21 U1.30
RMII_TXD0
  Top 0.152: U1.33 32.1,21.33 32.13,21.3 39.9,21.3 40.55,21.95 42.51,21.95 SV1.4
RMII_TXD1  (via drill 0.35)
  Top 0.152: U1.34 23.64,21.83 v23.43,21.62 | v24.13,20.32 39.05,20.32 SV1.1
  Bottom 0.152: v23.43,21.62 23.43,21.02 v24.13,20.32
SCL  (via drill 0.35)
  Top 0.152: SV3.5 17.78,5.08 17.78,9.39 v18.39,10 18.39,10.23 R5.1 | U1.58 18.3,25.83 v18.41,25.72
  Bottom 0.152: v18.39,10 18.41,10.03 18.41,10.16 18.39,10.19 18.39,17.71 18.41,17.74 v18.41,25.72
SDA  (via drill 0.35)
  Top 0.152: SV3.3 15.24,5.08 15.24,6.99 16.83,8.57 v16.83,9.84 17.46,10.48 R6.1 | U1.59 17.8,29.23 v17.46,28.89
  Bottom 0.152: v16.83,9.84 15.56,11.11 15.56,26.99 v17.46,28.89
SPI2_MISO  (via drill 0.35)
  Top 0.152: U1.56 19.3,33.27 20.91,34.88 33.93,34.88 v33.97,34.84
  Bottom 0.152: SV3.21 35.56,5.08 35.56,7.19 33.68,9.07 33.68,34.55 v33.97,34.84
SPI2_MOSI  (via drill 0.35)
  Top 0.152: U1.57 18.8,33.41 20.95,35.56 v33.02,35.56
  Bottom 0.152: SV3.19 33.02,5.08 v33.02,35.56
SPI2_NSS  (via drill 0.35)
  Top 0.152: U1.50 22.3,31.82 23.15,32.67 v36.2,32.67
  Bottom 0.152: SV3.24 39.37,7.62 36.2,10.79 v36.2,32.67
SPI2_SCK  (via drill 0.35)
  Top 0.152: U1.55 19.8,32.5 21.53,34.23 v35.24,34.23
  Bottom 0.152: SV3.23 38.1,5.08 38.1,7.62 35.24,10.48 v35.24,34.23
UART4_RX  (via drill 0.35)
  Top 0.152: v20.82,43.5 19.05,45.27 SV4.10 | U1.54 20.3,31.98 v21.95,33.63
  Bottom 0.152: v21.95,33.63 20.82,34.75 v20.82,43.5
UART4_TX  (via drill 0.35)
  Top 0.152: U1.53 20.8,31.57 v22.86,33.63
  Bottom 0.152: v22.86,33.63 22.86,45.09 SV4.9
USART0_RX  (via drill 0.35)
  Top 0.152: U1.43 26.11,26.33 26.42,26.64 38.33,26.64 v38.36,26.67
  Bottom 0.152: v38.36,26.67 38.36,41.85 | 38.36,41.85 40.64,44.13 | 40.64,44.13 J1.2 | 38.36,41.85 40.64,44.13
USART0_TX  (via drill 0.35)
  Top 0.152: U1.42 26.01,25.83 26.42,25.43 26.92,25.43 27.12,25.62 37.53,25.62 v37.75,25.4
  Bottom 0.152: v37.75,25.4 37.75,45.37 38.1,45.72 J1.3
USART2_RX  (via drill 0.35)
  Top 0.152: v21.27,26.99 21.3,27.02 U1.52
  Bottom 0.152: SV3.10 21.59,26.67 v21.27,26.99
USART2_TX  (via drill 0.35)
  Top 0.152: v21.91,28.26 21.8,28.36 U1.51
  Bottom 0.152: v21.91,28.26 21.68,28.26 19.05,25.62 SV3.8
USART5_RX  (via drill 0.35)
  Top 0.152: U1.38 23.78,23.83 23.75,23.8 22.24,23.8 v22.23,23.78
  Bottom 0.152: v22.23,23.78 22.23,7.75 22.9,7.08 22.9,5.04 SV3.11
USART5_TX  (via drill 0.35)
  Top 0.152: SV3.13 27.94,5.08 27.94,6.99 v30.16,9.21 | U1.37 28.2,23.33 28.32,23.21 v30.16,23.21
  Bottom 0.152: v30.16,9.21 v30.16,23.21
VBAT
  Top 0.254: U1.1 13.2,30.42 12.82,30.8 C15.1 12.38,30.8 12.38,34.92 12.7,35.24 D1.C 12.69,35.42 12.69,36.27 8.27,40.69 J2.2

### Text on the board
tNames: TX | RX | GND | 1 | ADC | RX_4 | TX_4 | DAC0 | DAC1 | GND | GND | NRST | SWDIO | SWCLK | VBAT+ | http://www.gd32-dmx.org | GND | VCC | GND | PA2 | PC1 | MDIO | MDC | PA1 | PA7 | REF / CLK | CRS | PC4 | PC5 | RXD0 | RXD1 | PB11 | PB12 | TXEN | TXD0 | PB13 | NC | TXD1 | NC | +5V | GND | +5V | +5V | GND | TX_2 | RX_2 | PB10 | GND | PB15 | PA13 / SWDIO | GND | PA11 | NSS | PA14 / SWCLK | POWER | +3V3 | SDA | SCL | PA6 | GND | RX_5 | TX_5 | PB14 | +3V3 | MOSI | MISO | SCK | GND